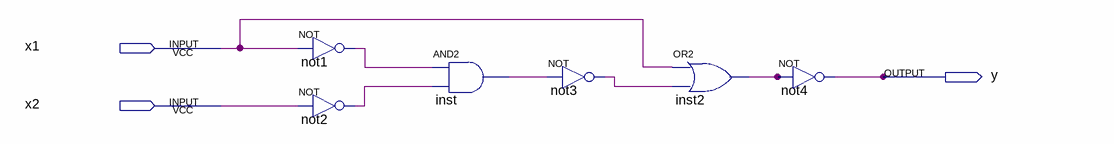
[diagram p0: schematic sheet]
// Quartus schematic first_prj.bdf as structural Verilog: 6 symbols, 3 pins
module first_prj (
  input  x1,
  input  x2,
  output y
);

  wire inst2_out, inst_out, not1_out, not2_out, not3_out;

  not not1 (not1_out, x1);
  not not2 (not2_out, x2);
  and inst (inst_out, not1_out, not2_out);
  not not3 (not3_out, inst_out);
  or inst2 (inst2_out, x1, not3_out);
  not not4 (y, inst2_out);
endmodule
